# Altium schematic sheet MCU.SchDoc
size A3; SheetNumber: 4; SheetTotal: 5
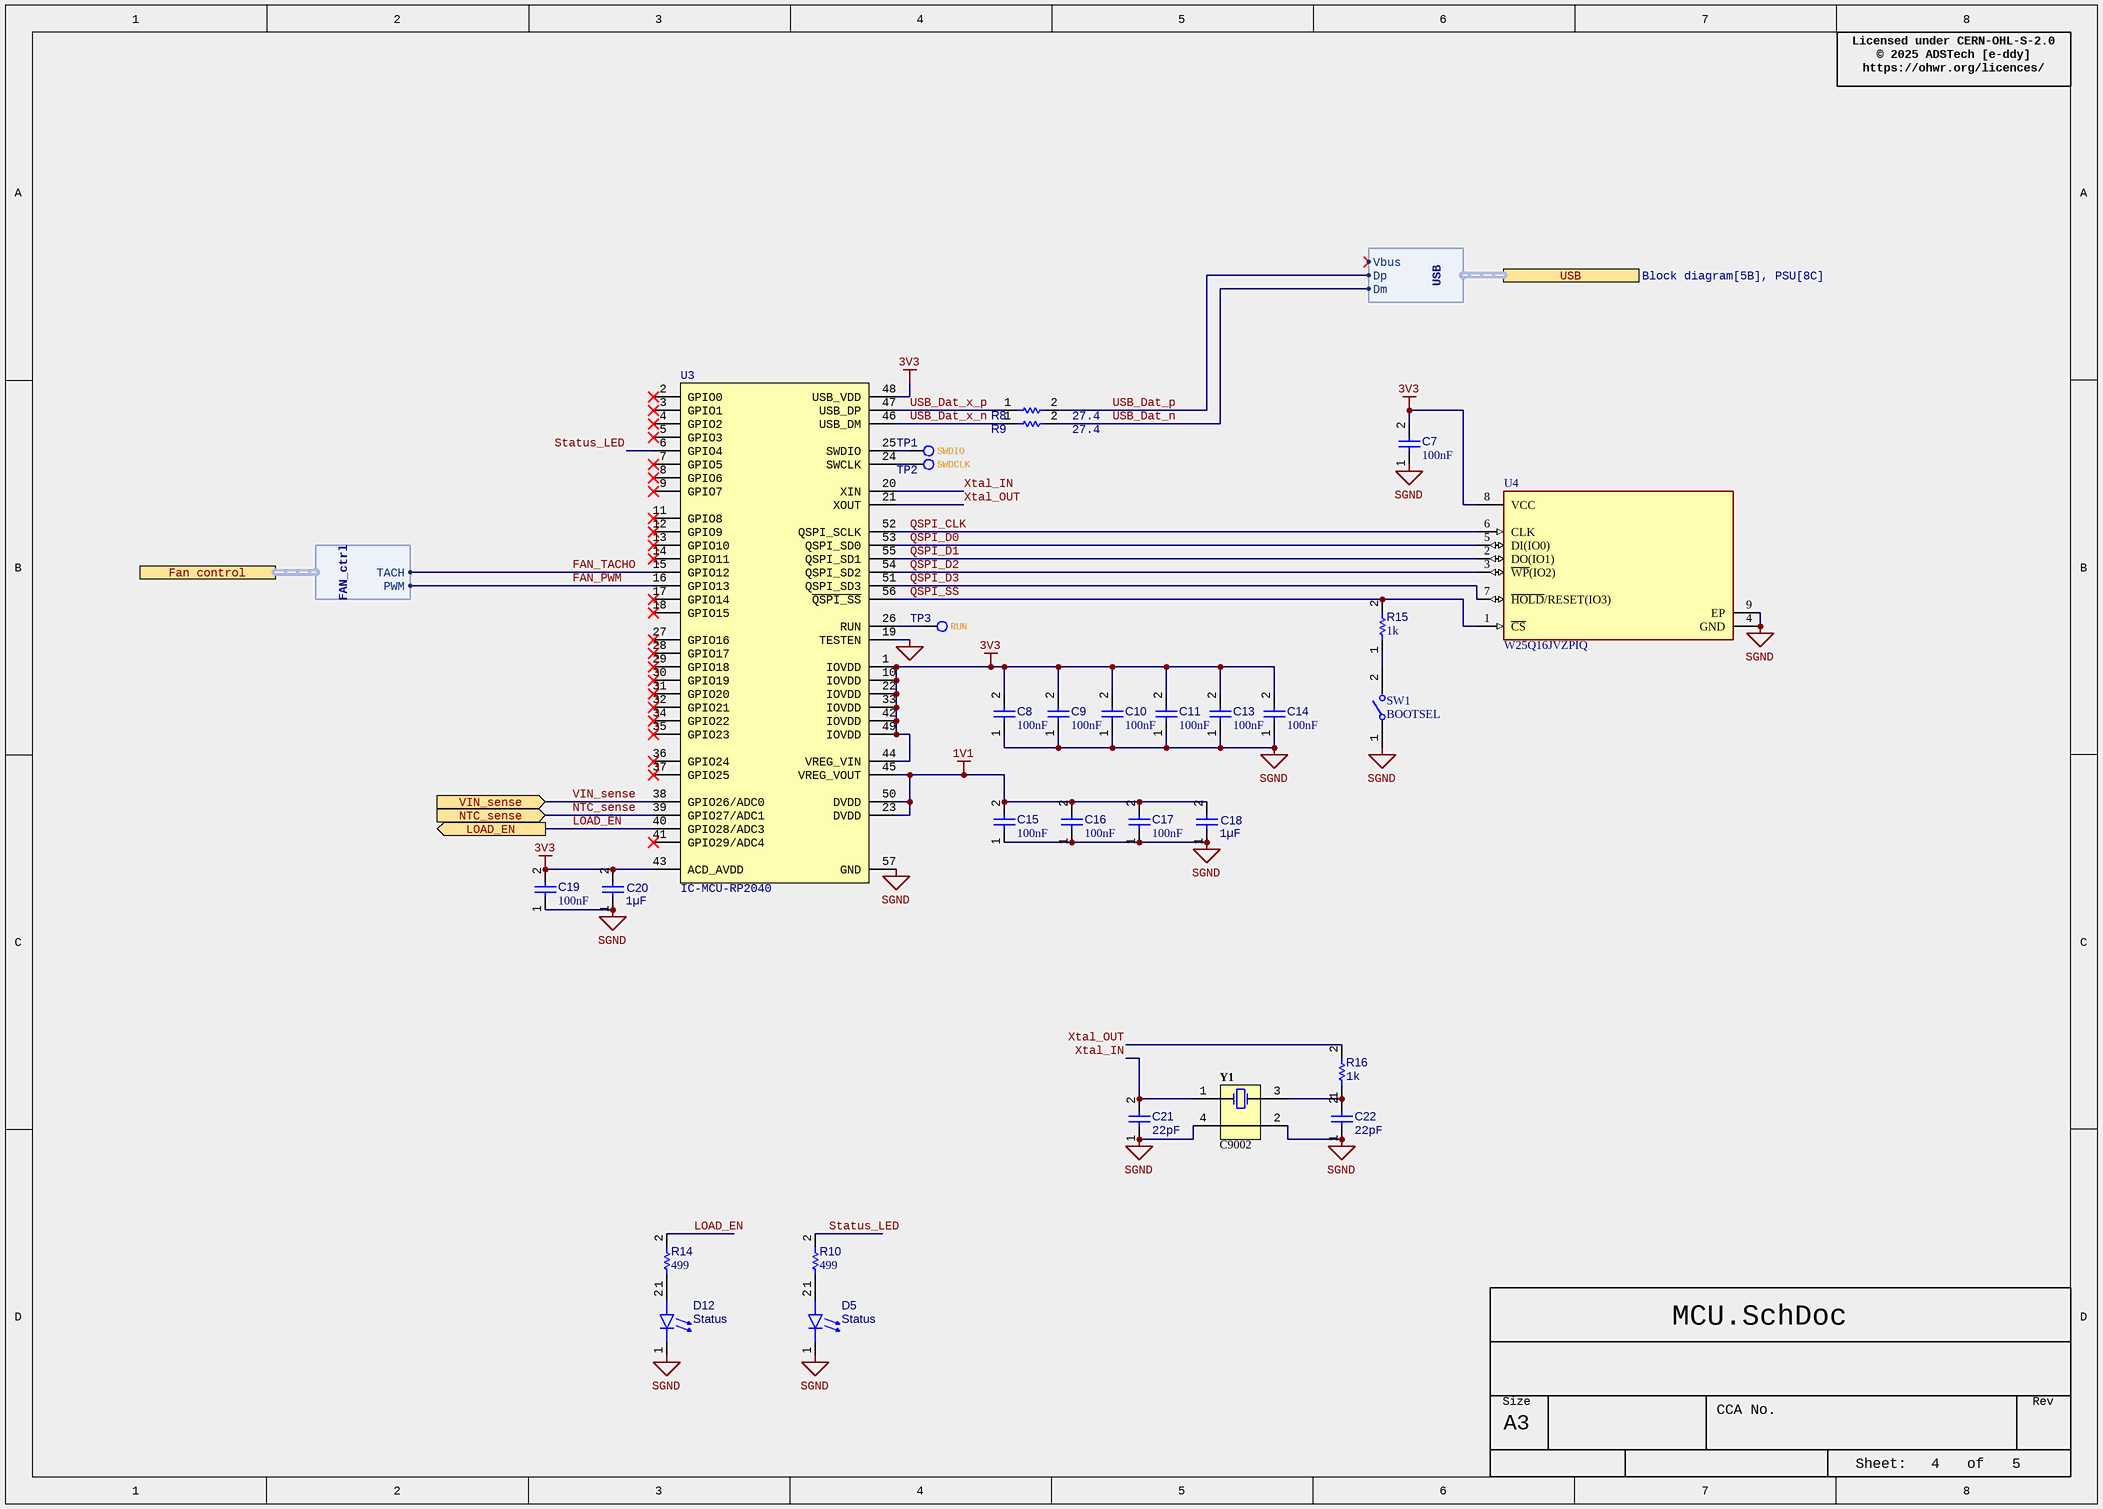
[diagram p0: MCU.SchDoc]

## Parts
C7  value 100nF  [CAP_0402-IPC_B]  (hidden comment: C-0402-CER-X7R-100nF-10%-50V)
C8  value 100nF  [CAP_0402-IPC_B]  (hidden comment: C-0402-CER-X7R-100nF-10%-50V)
C9  value 100nF  [CAP_0402-IPC_B]  (hidden comment: C-0402-CER-X7R-100nF-10%-50V)
C10  value 100nF  [CAP_0402-IPC_B]  (hidden comment: C-0402-CER-X7R-100nF-10%-50V)
C11  value 100nF  [CAP_0402-IPC_B]  (hidden comment: C-0402-CER-X7R-100nF-10%-50V)
C13  value 100nF  [CAP_0402-IPC_B]  (hidden comment: C-0402-CER-X7R-100nF-10%-50V)
C14  value 100nF  [CAP_0402-IPC_B]  (hidden comment: C-0402-CER-X7R-100nF-10%-50V)
C15  value 100nF  [CAP_0402-IPC_B]  (hidden comment: C-0402-CER-X7R-100nF-10%-50V)
C16  value 100nF  [CAP_0402-IPC_B]  (hidden comment: C-0402-CER-X7R-100nF-10%-50V)
C17  value 100nF  [CAP_0402-IPC_B]  (hidden comment: C-0402-CER-X7R-100nF-10%-50V)
C18  value 1µF  [CAP_0402-IPC_B]  (hidden comment: C-0402-CER-X5R-1µF-10%-25V)
C19  value 100nF  [CAP_0402-IPC_B]  (hidden comment: C-0402-CER-X7R-100nF-10%-50V)
C20  value 1µF  [CAP_0402-IPC_B]  (hidden comment: C-0402-CER-X5R-1µF-10%-25V)
C21  value 22pF  [CAP_0402-IPC_B]  (hidden comment: C-0402-C0G-22pF-50V-1%)
C22  value 22pF  [CAP_0402-IPC_B]  (hidden comment: C-0402-C0G-22pF-50V-1%)
D5  Status  [DIAL-0603-2_V]
D12  Status  [DIAL-0603-2_V]
R8  value 27.4  [RES-0402-IPC_B]  (hidden comment: R-0402-27.4-1%-100ppm-0.5)
R9  value 27.4  [RES-0402-IPC_B]  (hidden comment: R-0402-27.4-1%-100ppm-0.5)
R10  value 499  [RES-0402-IPC_B]  (hidden comment: R-0402-499.0-1%-100ppm-0.5)
R14  value 499  [RES-0402-IPC_B]  (hidden comment: R-0402-499.0-1%-100ppm-0.5)
R15  value 1k  [RES-0402-IPC_B]  (hidden comment: R-0402-1000.0-1%-100ppm-0.5)
R16  value 1k  [RES-0402-IPC_B]  (hidden comment: R-0402-1000.0-1%-100ppm-0.5)
SW1  BOOTSEL  [FP-B3U-1000P-MFG]
TP1  Name: SWDIO  [1.2mm test point - direct connect]  (hidden comment: TP-DIRECT-1.2mm)  (no BOM)
TP2  Name: SWDCLK  [1.2mm test point - direct connect]  (hidden comment: TP-DIRECT-1.2mm)  (no BOM)
TP3  Name: RUN  [1.2mm test point - direct connect]  (hidden comment: TP-DIRECT-1.2mm)  (no BOM)
U3  IC-MCU-RP2040  [QFN40P700X700X90_HS-57N]
U4  W25Q16JVZPIQ  [FP-ZP-IPC_B]
Y1  C9002  [FP-ABM8-MFG]

## Ports
Fan control (harness FAN_ctrl, see Block diagram[4C], Temperature and Fan[3C]), LOAD_EN (out, see Block diagram[4B], Power Switch[7C]), NTC_sense (in, see Block diagram[4C], Temperature and Fan[3B]), USB (harness USB, see Block diagram[5B], PSU[8C]), VIN_sense (in, see Block diagram[5B], PSU[6C])

## Harnesses
FAN_ctrl: PWM, TACH
USB: Vbus, Dm, Dp

## Nets
1V1: C15.2 C16.2 C17.2 C18.2 U3.23(DVDD) U3.45(VREG_VOUT) U3.50(DVDD)
3V3: C7.2 C8.2 C9.2 C10.2 C11.2 C13.2 C14.2 C19.2 C20.2 U3.1(IOVDD) U3.10(IOVDD) U3.22(IOVDD) U3.33(IOVDD) U3.42(IOVDD) U3.43(ACD_AVDD) U3.44(VREG_VIN) U3.48(USB_VDD) U3.49(IOVDD) U4.8(VCC)
SGND: C7.1 C8.1 C9.1 C10.1 C11.1 C13.1 C14.1 C15.1 C16.1 C17.1 C18.1 C19.1 C20.1 C21.1 C22.1 D5.1(K) D12.1(K) SW1.1 U3.19(TESTEN) U3.57(GND) U4.4(GND) U4.9(EP) Y1.2 Y1.4
~{QSPI_SS}: R15.2 U3.56(~{QSPI_SS}) U4.1(~{CS})
FAN_PWM: U3.16(GPIO13) ; port Fan control.PWM
FAN_TACHO: U3.15(GPIO12) ; port Fan control.TACH
LOAD_EN: R14.2 U3.40(GPIO28/ADC3) ; port LOAD_EN
NTC_sense: U3.39(GPIO27/ADC1) ; port NTC_sense
QSPI_CLK: U3.52(QSPI_SCLK) U4.6(CLK)
QSPI_D0: U3.53(QSPI_SD0) U4.5(DI(IO0))
QSPI_D1: U3.55(QSPI_SD1) U4.2(DO(IO1))
QSPI_D2: U3.54(QSPI_SD2) U4.3(~{WP}(IO2))
QSPI_D3: U3.51(QSPI_SD3) U4.7(~{HOLD}/RESET(IO3))
Status_LED: R10.2 U3.6(GPIO4)
USB_Dat_n: R9.2 ; port USB.Dm
USB_Dat_p: R8.2 ; port USB.Dp
USB_Dat_x_n: R9.1 U3.46(USB_DM)
USB_Dat_x_p: R8.1 U3.47(USB_DP)
VIN_sense: U3.38(GPIO26/ADC0) ; port VIN_sense
Xtal_IN: C21.2 U3.20(XIN) Y1.1
Xtal_OUT: R16.2 U3.21(XOUT)
NetC22_2: C22.2 R16.1 Y1.3
NetD5_2: D5.2(A) R10.1
NetD12_2: D12.2(A) R14.1
NetR15_1: R15.1 SW1.2
NetTP1_1: TP1.1 U3.25(SWDIO)
NetTP2_1: TP2.1 U3.24(SWCLK)
NetTP3_1: TP3.1 U3.26(RUN)

Not connected (* = marked no-connect by the designer): U3 2(GPIO0)* 3(GPIO1)* 4(GPIO2)* 5(GPIO3)* 7(GPIO5)* 8(GPIO6)* 9(GPIO7)* 11(GPIO8)* 12(GPIO9)* 13(GPIO10)* 14(GPIO11)* 17(GPIO14)* 18(GPIO15)* 27(GPIO16)* 28(GPIO17)* 29(GPIO18)* 30(GPIO19)* 31(GPIO20)* 32(GPIO21)* 34(GPIO22)* 35(GPIO23)* 36(GPIO24)* 37(GPIO25)* 41(GPIO29/ADC4)*

## Notes on the sheet
- Licensed under CERN-OHL-S-2.0
  © 2025 ADSTech [e-ddy]
  https://ohwr.org/licences/
- Size
- A3
- CCA No.
- Sheet:
- of
- Rev

## Library data of the parts
C7-C11 C13-C17 C19 = CMP-001-00003-5: Multilayer Ceramic Capacitor, 0.1 uF, 50 V, ± 10%, X7R, 0402 [1005 Metric]; Voltage Rating: 50V; Package Quantity: 50000; Pins: 2; Case Code (Imperial): 0402; RoHS Compliant: Yes; Voltage Rating (DC): 50V; Series: GRM; Max Operating Temperature: 125°C; Dielectric: X7R; Length: 0.039inch; Packaging: Tape and Reel; Thickness: 0.022inch; Material: Ceramic; Mounting Technology: Surface Mount; Tolerance: 10%; Lead Free: Lead Free; Case Code (Metric): 1005; Case/Package: 0402; Width: 0.02inch; Termination: SMD/SMT; Weight: 0.000212oz; Min Operating Temperature: -55°C; Height: 0.5mm
C18 C20 = CMP-001-00015-3: Ceramic Capacitor, Multilayer, Ceramic, 25V, 10% +Tol, 10% -Tol, X5R, 15% TC, 1uF, Surface Mount, 0402; Multilayer: Yes; Package Shape: Rectangular; Height: 0.5mm; Tolerance  (fill in as +-): 10%; Mounting Technology: Surface Mount; Pins: 2; Rated DC Voltage (URdc): 25V; Width: 0.5mm; Termination: Wraparound; Reach SVHC Compliant: Yes; Capacitor Type: Ceramic; Max Operating Temperature: 85°C; Temperature Characteristics Code: X5R; Terminal Finish: Nickel; Case/Package: 0402; Length: 1mm; Min Operating Temperature: -55°C; JESD-609 Code: e3; Packaging: Tape and Reel; Tolerance (fill in as +-): 10%; Dielectric Material: Ceramic; RoHS Compliant: Yes; Package Style: SMTMeter
C21 C22 = CMP-00074-3: Multilayer Ceramic Capacitors MLCC - SMD/SMT 50V 22pF C0G 0402 +/-1%; Tolerance: 1%; Package: 0402; Dielectric: C0G
D5 D12 = CMP-007-00005-2: Red 633nm 0603 LED; Forward Current: 20mA; Forward Voltage: 2.1V; Viewing Angle: 140; Reverse Voltage: 5; Max Power Dissipation: 72mW; Wavelength: 633; Case/Package: 0603; Max Operating Temperature: 100°C; RoHS Compliant: Yes; Colour: Red; Mounting Technology: SMT; Min Operating Temperature: -40°C; Nominal Vf: 2.1V; Pins: 2
R8 R9 = RES-0402-00042-5: 0402 27.4 Ω 1% 100ppm 0.063W Resistor; MPN: CRCW040227R4FKED; Power: 63mW; Package: 0402; Tolerance: 1%; TCR: 100ppm
R10 R14 = RES-0402-00163-5: 0402 499.0 Ω 1% 100ppm 0.063W Resistor; MPN: CRCW0402499RFKED; Power: 63mW; Tolerance: 1%; Package: 0402; TCR: 100ppm
R15 R16 = RES-0402-00192-5: 0402 1000.0 Ω 1% 100ppm 0.063W Resistor; MPN: CRCW04021K00FKED; Power: 63mW; TCR: 100ppm; Tolerance: 1%; Package: 0402
SW1 = CMP-011-00003-1: Keypad Switch, 1 Switches, SPST, Momentary-tactile, 0.05A, 12VDC, 1.99N, Solder Terminal, Surface Mount-straight; Body Breadth: 2.5mm; Body Length or Diameter: 3mm; Insulation Resistance: 100MR; Contact Bounce Time-Max: 5ms; Contact Voltage(DC)-Max: 12V; Contact Current(DC)-Max: 50mA; Dielectric Withstand Volts: 250VACV; Sealing: DUST PROOF; Contact Resistance: 0.1mR; Contact DC Max Rating R Load: .05A@12VDC; Additional Feature: ROHS COMPLIANT; Body Height: 1.2mm; Contact Function: (N.O.) (N.C.); Circuit Configuration: 1X1; Number of Switches: 1; Switch Function: SPST; Reach SVHC Compliant: Yes; Actuator Type: Keypad; Min Operating Temperature: -25°C; Switch Type: Keypad; Terminal Length: 0inch; Switch Action: MOMENTARY-TACTILE; Operating Force-Max: 1.99N; Max Operating Temperature: 70°C; Terminal Finish: Silver; Mounting Technology: Surface Mount; JESD-609 Code: e4; RoHS Compliant: Yes; Termination: Solder; Packaging: Tape and Reel
TP1-TP3 = CMP-00095-4: 1.2mm standard round test point with direct connect
U3 = CMP-020-00000-2: 264KB 30 133MHZ LQFN-56(7X7) Microcontrollers (mcu/mpu/soc) Rohs
U4 = CMP-78876-000010-1: IC FLASH 16MBIT SPI/QUAD 8WSON; Frequency: 133MHz; Memory Size: 16Mb; Memory Type: Non-Volatile; Packaging: Rail/Tube; Mount: Surface Mount; Min Operating Temperature: -40°C; Max Operating Temperature: 85°C
Y1 = CMP-003-00005-1: Crystal 12MHz ±20ppm (Tol) ±50ppm (Stability) 18pF FUND 120Ohm 4-Pin Ultra Mini-CSMD T/R; ESR: 120; ESR (Equivalent Series Resistance): 120R; Mounting Technology: Surface Mount; Width: 2.5mm; Reach SVHC Compliant: No; Termination: SMD/SMT; Frequency Tolerance: 20ppm; Tolerance: 20ppm; Pins: 4; Height: 0.8mm; Min Operating Temperature: -20°C; Packaging: Tape and Reel; Package Quantity: 1000; Operating Frequency: 12 MHz; Frequency: 12MHz; Lead Free: Lead Free; Load Capacitance: 18pF; Depth: 2.5mm; Max Operating Temperature: 70°C; Case/Package: CSMD; RoHS Compliant: Yes; Frequency Stability: 50ppm; Length: 3.2mm; Radiation Hardening: No; Series: ABM8